# Altium project PiTopAIO.PrjPcb
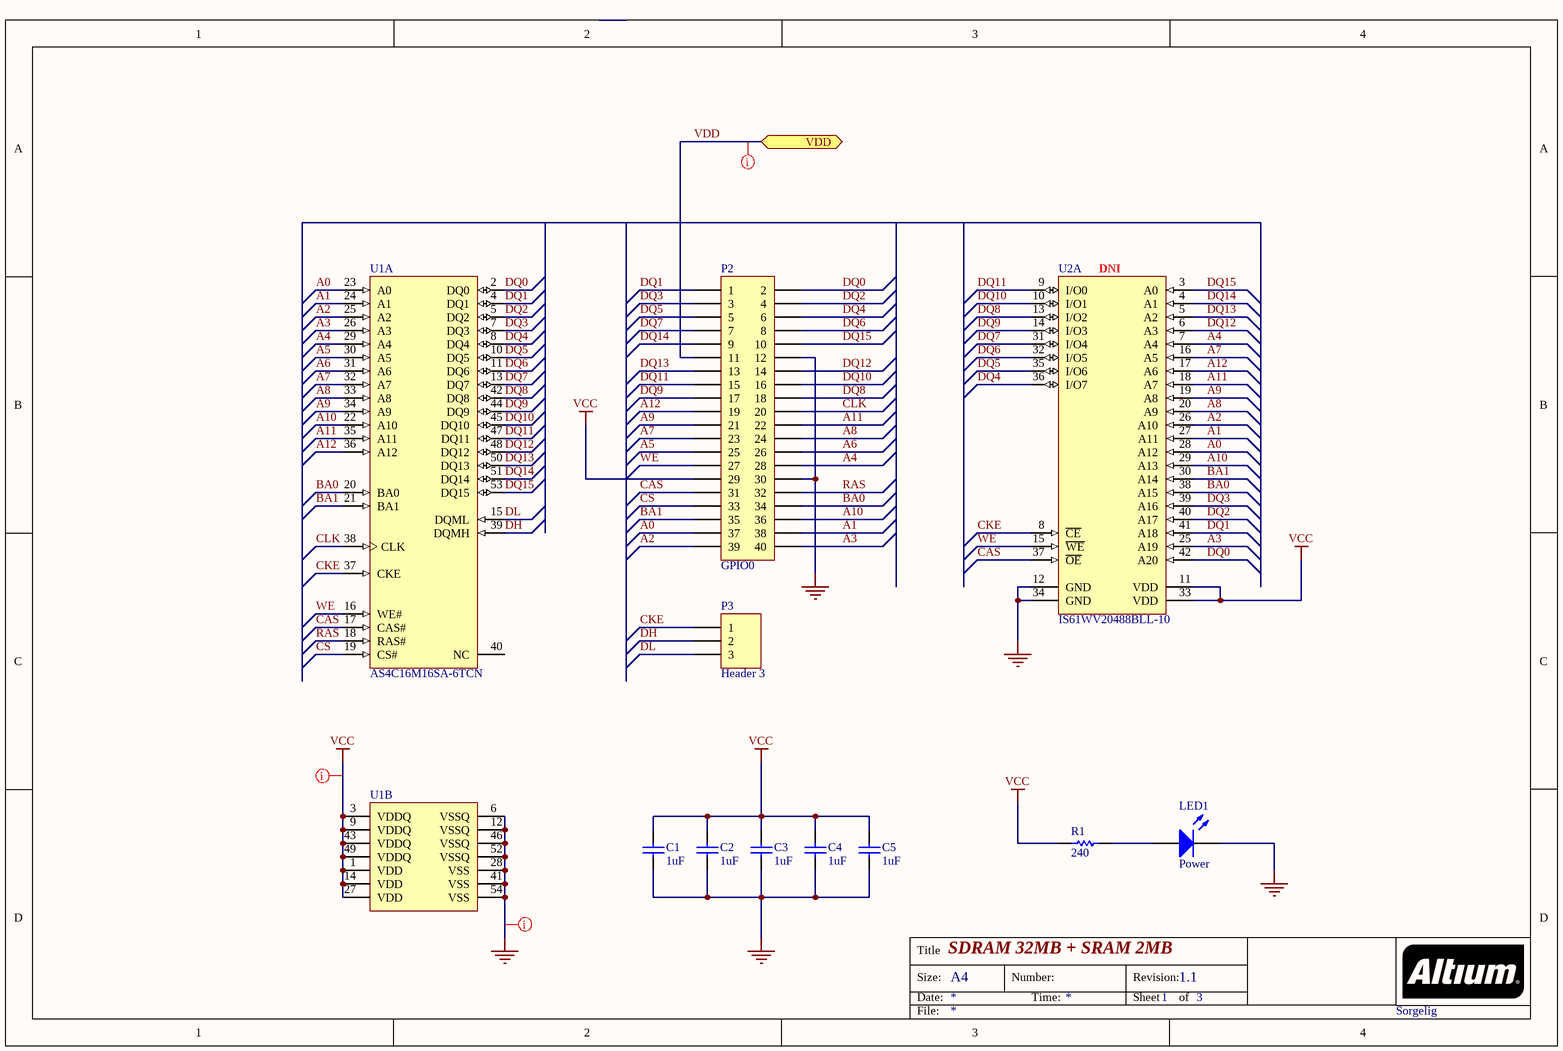
[diagram p0: ram.SchDoc]
3 sheets, 61 parts. Net scope: flat (ports and power ports of the same name join across sheets).
Board file: PiTopAIO.PcbDoc
Sheets:
  ram.SchDoc
  audio.SchDoc
  io.SchDoc

## Sheet ram.SchDoc: SDRAM 32MB + SRAM 2MB
size A4; Author: Sorgelig; Revision: 1.1; SheetNumber: 1; SheetTotal: 3

### Parts
C1  value 1uF  [C0805]  (hidden comment: C0805)
C2  value 1uF  [C0805]  (hidden comment: C0805)
C3  value 1uF  [C0805]  (hidden comment: +)
C4  value 1uF  [C0805]  (hidden comment: C0805)
C5  value 1uF  [C0805]  (hidden comment: +)
LED1  Power  [LEDB0805]
P2  GPIO0  [HDR20x2]
P3  Header 3  [HDR1X3]
R1  240  [R0805]
U1  AS4C16M16SA-6TCN  [TSOP54]  (parts A,B of 2)
U2  IS61WV20488BLL-10  [ISSI-TSOP-2-44_N]  (part A of 2)

### Ports
VDD

### Nets
GND: C1.1 C2.1 C3.1 C4.1 C5.1 LED1.2(K) P2.12 P2.30 U1.6(VSSQ) U1.12(VSSQ) U1.28(VSS) U1.41(VSS) U1.46(VSSQ) U1.52(VSSQ) U1.54(VSS) U2.12(GND) U2.34(GND)
VCC: C1.2 C2.2 C3.2 C4.2 C5.2 P2.29 R1.2 U1.1(VDD) U1.3(VDDQ) U1.9(VDDQ) U1.14(VDD) U1.27(VDD) U1.43(VDDQ) U1.49(VDDQ) U2.11(VDD) U2.33(VDD)
VDD: P2.11 ; port VDD
A0: P2.37 U1.23(A0) U2.28(A12)
A1: P2.38 U1.24(A1) U2.27(A11)
A2: P2.39 U1.25(A2) U2.26(A10)
A3: P2.40 U1.26(A3) U2.25(A19)
A4: P2.28 U1.29(A4) U2.7(A4)
A5: P2.25 U1.30(A5)
A6: P2.26 U1.31(A6)
A7: P2.23 U1.32(A7) U2.16(A5)
A8: P2.24 U1.33(A8) U2.20(A9)
A9: P2.21 U1.34(A9) U2.19(A8)
A10: P2.36 U1.22(A10) U2.29(A13)
A11: P2.22 U1.35(A11) U2.18(A7)
A12: P2.19 U1.36(A12) U2.17(A6)
BA0: P2.34 U1.20(BA0) U2.38(A15)
BA1: P2.35 U1.21(BA1) U2.30(A14)
CAS: P2.31 U1.17(CAS#) U2.37(~{OE})
CKE: P3.1 U1.37(CKE) U2.8(~{CE})
CLK: P2.20 U1.38(CLK)
CS: P2.33 U1.19(CS#)
DH: P3.2 U1.39(DQMH)
DL: P3.3 U1.15(DQML)
DQ0: P2.2 U1.2(DQ0) U2.42(A20)
DQ1: P2.1 U1.4(DQ1) U2.41(A18)
DQ2: P2.4 U1.5(DQ2) U2.40(A17)
DQ3: P2.3 U1.7(DQ3) U2.39(A16)
DQ4: P2.6 U1.8(DQ4) U2.36(I/O7)
DQ5: P2.5 U1.10(DQ5) U2.35(I/O6)
DQ6: P2.8 U1.11(DQ6) U2.32(I/O5)
DQ7: P2.7 U1.13(DQ7) U2.31(I/O4)
DQ8: P2.18 U1.42(DQ8) U2.13(I/O2)
DQ9: P2.17 U1.44(DQ9) U2.14(I/O3)
DQ10: P2.16 U1.45(DQ10) U2.10(I/O1)
DQ11: P2.15 U1.47(DQ11) U2.9(I/O0)
DQ12: P2.14 U1.48(DQ12) U2.6(A3)
DQ13: P2.13 U1.50(DQ13) U2.5(A2)
DQ14: P2.9 U1.51(DQ14) U2.4(A1)
DQ15: P2.10 U1.53(DQ15) U2.3(A0)
RAS: P2.32 U1.18(RAS#)
WE: P2.27 U1.16(WE#) U2.15(~{WE})
NetLED1_1: LED1.1(A) R1.1

Not connected (* = marked no-connect by the designer): U1 40(NC)

### Layout directives
net class power: GND, VCC, VDD

### Notes on the sheet
- (near U2) DNI
- Sorgelig
- Title
- Size:
- Date:
- A4
- Number:
- Time:
- Revision:
- Sheet
- of
- File:

### Library data of the parts
C1-C5 = C0805: Ceramic Chip Capacitor - Standard; Note: Footprint corresponds to dimensions for bulk cassette packaging. This case size has tightened tolerances.; Published: 17-Jul-2002; LatestRevisionDate: 19-Mar-2004; LatestRevisionNote: Silkscreen size reduced.; DatasheetDocument: Mar-2001; PackageDocument: Mar-2001; PackageReference: 0805; Publisher: Altium Limited; Code_JEITA: 0805; Code_IPC: 2012[0805]; ComponentLink1Description: Manufacturer Link; ComponentLink1URL: http://www.kemet.com/; ComponentLink2Description: Datasheet; ComponentLink2URL: http://www.kemet.com/kemet/web/homepage/kechome.nsf/vapubfilesname/F3102TA.pdf/$file/F3102TA.pdf
LED1 = LED2: Typical RED, GREEN, YELLOW, AMBER GaAs LED; Published: 8-Jun-2000; LatestRevisionDate: 17-Jul-2002; LatestRevisionNote: Re-released for DXP Platform.; PackageVersion: Feb-2002; PackageReference: 3.2X1.6X1.1; Publisher: Altium Limited; PackageDescription: SM LED; 2 Flat Leads
P2 = Header 20X2: Header, 20-Pin, Dual row; LatestRevisionDate: 17-Jul-2002; LatestRevisionNote: Re-released for DXP Platform.; Publisher: Altium Limited
P3 = Header 3: Header, 3-Pin; LatestRevisionDate: 17-Jul-2002; LatestRevisionNote: Re-released for DXP Platform.; Publisher: Altium Limited
R1 = ERJ6RS: Low Ohmic Value Thick Film Chip Resistor, 0.1 Ohm to 0.2 Ohm Range, 1%, 2% and 5% Tolerance, 0805 Size, 0.125 W; Published: 17-Dec-2003; LatestRevisionDate: 19-Mar-2004; LatestRevisionNote: Silkscreen size reduced.; PackageDocument: Mar-2003; PackageReference: 6-0805; Publisher: Altium Limited; Code_IPC: 2012 [0805]; ComponentLink1Description: Manufacturer Link; ComponentLink1URL: http://www.panasonic.com/industrial/components/resistive_products.htm; ComponentLink2Description: Datasheet; ComponentLink2URL: http://www.panasonic.com/industrial/components/pdf/AOA0000CE3.pdf
U1 = AS4C16M16SA-6TCN: 256Mb SDR SDRAM, 16Mb x 16, 6ns, 3.3V, 54-Pin TSOP; Manufacturer: Micron; PartNumber: MT48LC16M16A2P-6A; CL: CL = 3; Clock Rate: 167 MHz; Data Rate: PC133; Op. Temp.: 0C to +70C; DatasheetVersion: Rev.Q; PackageVersion: Rev.Q; PackageReference: MICT-P-54; PackageDescription: 54-Pin Thin Small Outline Package, 10.16 x 22.22 mm, Pitch 0.8 mm; Cycle Time: 6ns; Density: 256Mb; Depth: 16Mb; RoHS: Yes; Voltage: 3.3V; Width: x16; Mounting Technology: Surface Mount; ComponentLink1Description: Manufacturer URL; ComponentLink1URL: http://www.micron.com/; ComponentLink2Description: Datasheet; ComponentLink2URL: http://www.micron.com/~/media/Documents/Products/Data%20Sheet/DRAM/256Mb_sdr.pdf; ComponentLink3Description: Package Specification; ComponentLink3URL: http://www.micron.com/~/media/Documents/Products/Data%20Sheet/DRAM/128mb_x4x8x16_sdram.pdf
U2 = IS61WV20488BLL-10TI: 16 M High Speed CMOS SRAM, 2 M x 8, -40 to 85 degC, 44-Pin SOP (TSOP-2-44); Manufacturer: Integrated Silicon Solution Inc (ISSI); Organization: 2M x 8; Packing: Tray / Tube; Speed (ns): 10; DatasheetVersion: Rev. B; PackageVersion: Rev. F, 06/2008; PackageReference: TSOP-2-44; PackageDescription: 44-Pin 400 mil TSOP-2, Body 18.41 x 10.16 mm, Pitch 0.8 mm; Mounting Technology: Surface Mount; PartNumber: IS61WV20488BLL-10TI; ComponentLink1Description: Manufacturer URL; ComponentLink1URL: http://www.issi.com/US/index.shtml; ComponentLink2Description: Datasheet; ComponentLink2URL: http://www.issi.com/WW/pdf/61-64WV20488.pdf; ComponentLink3Description: Package Specification; ComponentLink3URL: http://www.issi.com/WW/pdf/61-64WV6416EEBLL.pdf

## Sheet audio.SchDoc: Audio
size A4; Author: Sorgelig; Revision: 1.1; SheetNumber: 2; SheetTotal: 3
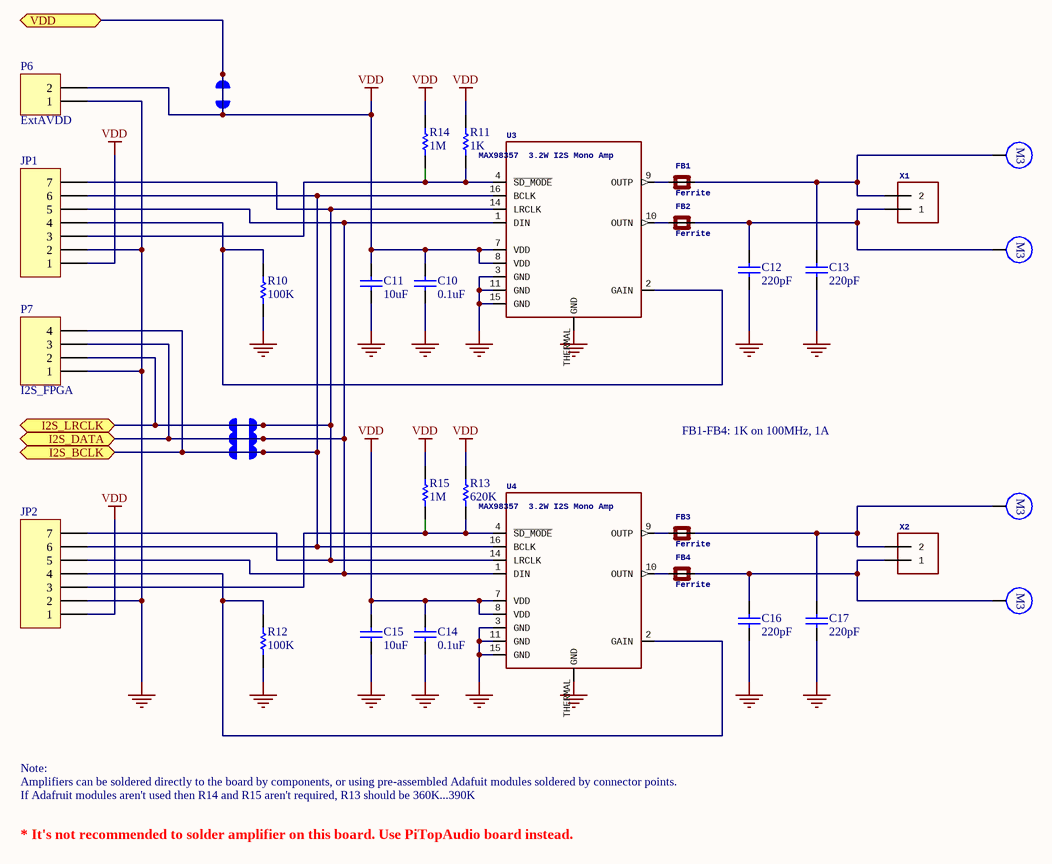
[diagram p1: audio.SchDoc]

### Parts
C10  value 0.1uF  [C0805]  (hidden comment: C0805)
C11  value 10uF  [C0805]  (hidden comment: C0805)
C12  value 220pF  [C0805]  (hidden comment: C0805)
C13  value 220pF  [C0805]  (hidden comment: C0805)
C14  value 0.1uF  [C0805]  (hidden comment: C0805)
C15  value 10uF  [C0805]  (hidden comment: C0805)
C16  value 220pF  [C0805]  (hidden comment: C0805)
C17  value 220pF  [C0805]  (hidden comment: C0805)
CUT1  CUT  [CUT]  (value not drawn)
CUT2  CUT  [CUT]  (value not drawn)
CUT3  CUT  [CUT]  (value not drawn)
CUT4  CUT  [CUT]  (value not drawn)
FB1  Ferrite  [FB0805]
FB2  Ferrite  [FB0805]
FB3  Ferrite  [FB0805]
FB4  Ferrite  [FB0805]
H11  M3  [M3]  (value not drawn)
H12  M3  [M3]  (value not drawn)
H13  M3  [M3]  (value not drawn)
H14  M3  [M3]  (value not drawn)
JP1  Header 7  [HDR1X7]  (value not drawn)
JP2  Header 7  [HDR1X7]  (value not drawn)
P6  ExtAVDD  [HDR1X2]
P7  I2S_FPGA  [HDR1X4]
R10  100K  [R0805]
R11  1K  [R0805]
R12  100K  [R0805]
R13  620K  [R0805]
R14  1M  [R0805]
R15  1M  [R0805]
U3  MAX98357
3.2WI2SMonoAmp: MAX98357 / 3.2W I2S Mono Amp  [QFN16_3MM]  (hidden comment: MAX98357A)
U4  MAX98357
3.2WI2SMonoAmp: MAX98357 / 3.2W I2S Mono Amp  [QFN16_3MM]  (hidden comment: MAX98357A)
X1  TERMBLOCK_1X2  [TERMBLOCK_1X2-3.5MM]  (value not drawn)
X2  TERMBLOCK_1X2  [TERMBLOCK_1X2-3.5MM]  (value not drawn)

### Ports
I2S_BCLK, I2S_DATA, I2S_LRCLK, VDD

### Nets
GND: C10.1 C11.1 C12.1 C13.1 C14.1 C15.1 C16.1 C17.1 JP1.2 JP2.2 P6.1 P7.1 R10.2 R12.2 U3.3(GND) U3.11(GND) U3.15(GND) U3.THERMAL(GND) U4.3(GND) U4.11(GND) U4.15(GND) U4.THERMAL(GND)
VDD: C10.2 C11.2 C14.2 C15.2 CUT4.1 JP1.1 JP2.1 P6.2 R11.1 R13.1 R14.1 R15.1 U3.7(VDD) U3.8(VDD) U4.7(VDD) U4.8(VDD) ; port VDD
I2S_BCLK: CUT1.1 JP1.6 JP2.6 P7.4 U3.16(BCLK) U4.16(BCLK) ; port I2S_BCLK
I2S_DATA: CUT3.1 JP1.5 JP2.5 P7.3 U3.1(DIN) U4.1(DIN) ; port I2S_DATA
I2S_LRCLK: CUT2.1 JP1.7 JP2.7 P7.2 U3.14(LRCLK) U4.14(LRCLK) ; port I2S_LRCLK
NetC12_2: C12.2 FB2.2(P$2) H12.1 X1.1
NetC13_2: C13.2 FB1.2(P$2) H11.1 X1.2
NetC16_2: C16.2 FB4.2(P$2) H14.1 X2.1
NetC17_2: C17.2 FB3.2(P$2) H13.1 X2.2
NetFB1_1: FB1.1(P$1) U3.9(OUTP)
NetFB2_1: FB2.1(P$1) U3.10(OUTN)
NetFB3_1: FB3.1(P$1) U4.9(OUTP)
NetFB4_1: FB4.1(P$1) U4.10(OUTN)
NetJP1_3: JP1.3 R11.2 R14.2 U3.4(~{SD_MODE})
NetJP1_4: JP1.4 R10.1 U3.2(GAIN)
NetJP2_3: JP2.3 R13.2 R15.2 U4.4(~{SD_MODE})
NetJP2_4: JP2.4 R12.1 U4.2(GAIN)

### Notes on the sheet
- FB1-FB4: 1K on 100MHz, 1A
- Note:
- Amplifiers can be soldered directly to the board by components, or using pre-assembled Adafuit modules soldered by connector points.
- If Adafruit modules aren't used then R14 and R15 aren't required, R13 should be 360K...390K
- * It's not recommended to solder amplifier on this board. Use PiTopAudio board instead.
- Title
- Size:
- Date:
- A4
- Number:
- Time:
- Revision:
- Sheet
- of
- File:

### Library data of the parts
C10-C17 = C0805: as C1 on sheet ram; Published: 17-Jul-2002; LatestRevisionDate: 19-Mar-2004; LatestRevisionNote: Silkscreen size reduced.; DatasheetDocument: Mar-2001; PackageDocument: Mar-2001; PackageReference: 0805; Publisher: Altium Limited; Code_JEITA: 0805; Code_IPC: 2012[0805]; ComponentLink1Description: Manufacturer Link; ComponentLink1URL: http://www.kemet.com/; ComponentLink2Description: Datasheet; ComponentLink2URL: http://www.kemet.com/kemet/web/homepage/kechome.nsf/vapubfilesname/F3102TA.pdf/$file/F3102TA.pdf
FB1-FB4 = FERRITE-0805NO: Ferrite Bead   0603 MMZ1608B121C - 120 Ohm @ 100MHz, 600mA, 0.15 Ohm DC Resistance - Digikey: 445-2164-1-ND  BK1608HW121-T - 120 Ohm, 600mA Ferrite Chip - Digikey: 587-1876-2-ND       0805 HZ0805B272R-10 - 2.7K Ohm @ 100MHz, 200mA, 0.8 Ohm DC Resistance - Digikey: 240-2504-1-ND (see also Murata BLM21BD272SN1L)  MMZ2012Y152B - 1.5K Ohm @ 100MHz, 500mA, 0.4 Ohm DC Resistance - Digikey: 445-1560-1-ND - Mainly for high frequency (80-400MHz)  MMZ2012R102A - 1K Ohm @ 100MHz, 500mA, 0.3 Ohm DC Resistance - Digikey: 445-1555-2-ND - More general purpose (10-200MHz)
JP1 JP2 = Header 7: Header, 7-Pin; LatestRevisionDate: 17-Jul-2002; LatestRevisionNote: Re-released for DXP Platform.; Publisher: Altium Limited
P6 = Header 2: Header, 2-Pin; LatestRevisionDate: 17-Jul-2002; LatestRevisionNote: Re-released for DXP Platform.; Publisher: Altium Limited
P7 = Header 4: Header, 4-Pin; LatestRevisionDate: 17-Jul-2002; LatestRevisionNote: Re-released for DXP Platform.; Publisher: Altium Limited
R10-R15 = ERJ6RS: as R1 on sheet ram; Published: 17-Dec-2003; LatestRevisionDate: 19-Mar-2004; LatestRevisionNote: Silkscreen size reduced.; PackageDocument: Mar-2003; PackageReference: 6-0805; Publisher: Altium Limited; Code_IPC: 2012 [0805]; ComponentLink1Description: Manufacturer Link; ComponentLink1URL: http://www.panasonic.com/industrial/components/resistive_products.htm; ComponentLink2Description: Datasheet; ComponentLink2URL: http://www.panasonic.com/industrial/components/pdf/AOA0000CE3.pdf
U3 U4 = MAX98357: MAX98357 - 3.2W I2S Mono Audio Amp; VDD:
Op.Temp: VDD: / Op. Temp:; 2.5-5.5V
-40~85В°C: 2.5-5.5V / -40~85В°C
X1 X2 = TERMBLOCK_1X2: 3.5mm Terminal block    http://www.ladyada.net/library/pcb/eaglelibrary.html

## Sheet io.SchDoc: SD Cards
size A4; Author: Sorgelig; Revision: 1.1; SheetNumber: 3; SheetTotal: 3
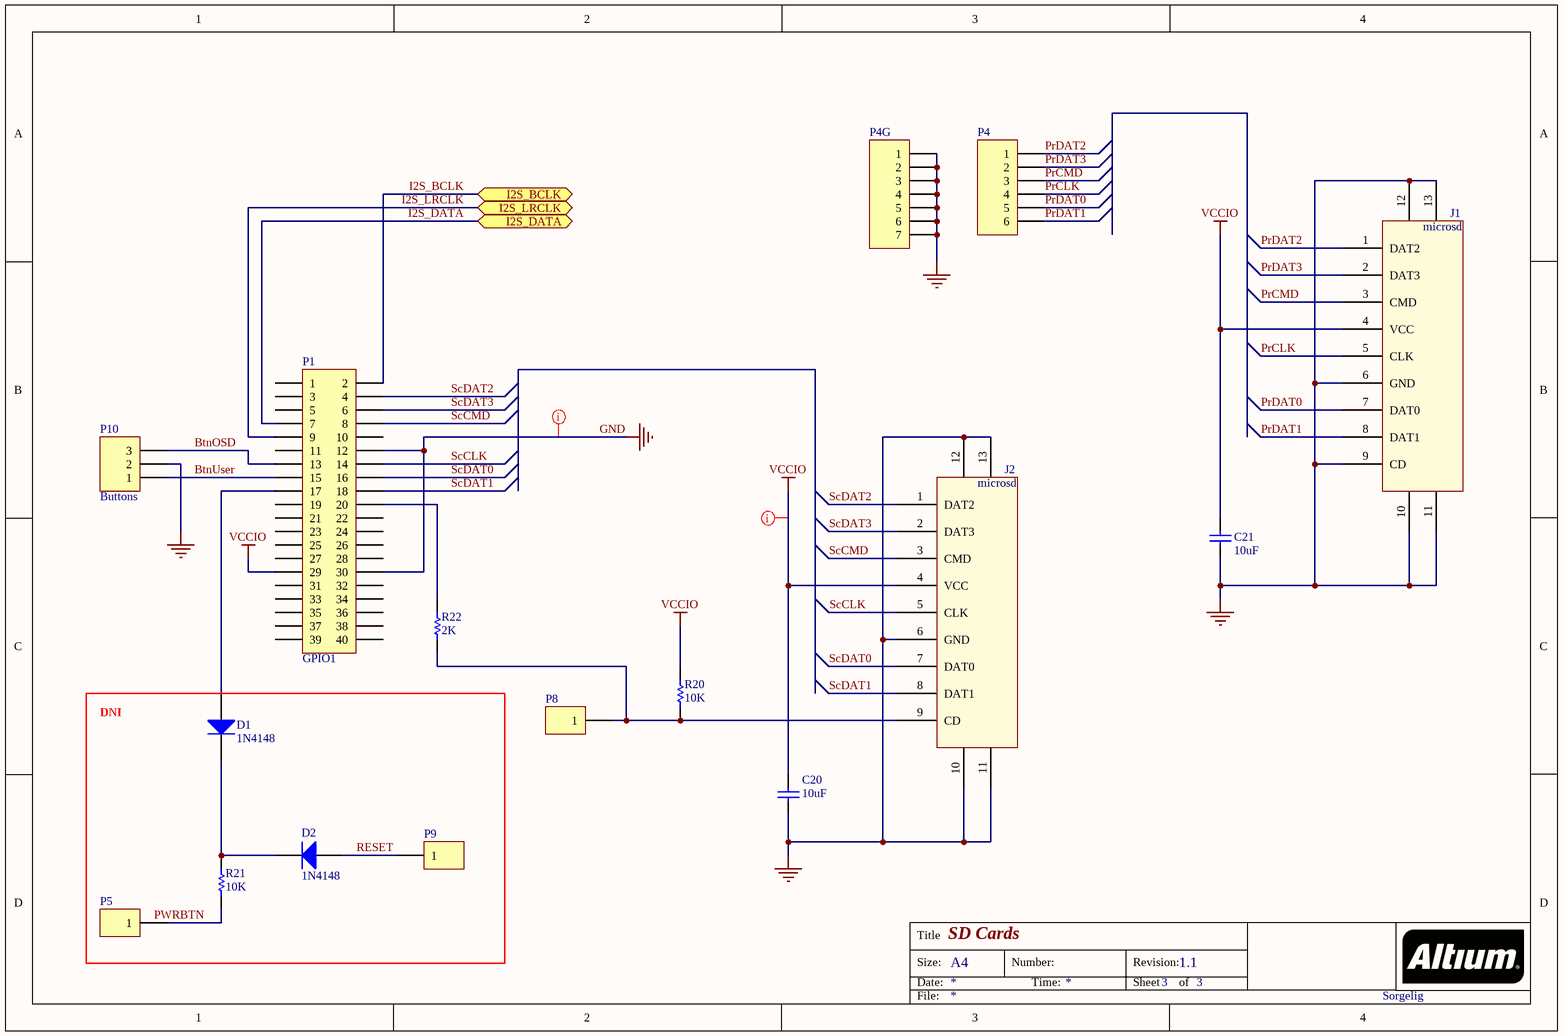
[diagram p2: io.SchDoc]

### Parts
C20  value 10uF  [C0805]  (hidden comment: C0805)
C21  value 10uF  [C0805]  (hidden comment: C0805)
D1  1N4148  [DIODE]
D2  1N4148  [DIODE]
J1  microsd  [microsd]
J2  microsd  [microsd]
P1  GPIO1  [HDR20x2]
P4  Header 6  [HDR1X6]  (value not drawn)
P4G  Header 7  [HDR1X7]  (value not drawn)
P5  Header 1  [Header 1]  (value not drawn)
P8  Header 1  [Header 1]  (value not drawn)
P9  Header 1  [Header 1]  (value not drawn)
P10  Buttons  [HDR1X3]
R20  10K  [R0805]
R21  10K  [R0805]
R22  2K  [R0805]

### Blocks framed on the sheet
DNI: D1 D2 P5 P9 R21

### Ports
I2S_BCLK, I2S_DATA, I2S_LRCLK

### Nets
GND: C20.1 C21.1 J1.6(GND) J1.9(CD) J1.10(GND) J1.11(GND) J1.12(GND) J1.13(GND) J2.6(GND) J2.10(GND) J2.11(GND) J2.12(GND) J2.13(GND) P1.12 P1.30 P4G.1 P4G.2 P4G.3 P4G.4 P4G.5 P4G.6 P4G.7 P10.2
VCCIO: C20.2 C21.2 J1.4(VCC) J2.4(VCC) P1.29 R20.2
BtnOSD: P1.13 P10.3
BtnUser: P1.15 P10.1
I2S_BCLK: P1.2 ; port I2S_BCLK
I2S_DATA: P1.7 ; port I2S_DATA
I2S_LRCLK: P1.9 ; port I2S_LRCLK
PrCLK: J1.5(CLK) P4.4
PrCMD: J1.3(CMD) P4.3
PrDAT0: J1.7(DAT0) P4.5
PrDAT1: J1.8(DAT1) P4.6
PrDAT2: J1.1(DAT2) P4.1
PrDAT3: J1.2(DAT3) P4.2
RESET: D2.1(A) P9.1
ScCLK: J2.5(CLK) P1.14
ScCMD: J2.3(CMD) P1.8
ScDAT0: J2.7(DAT0) P1.16
ScDAT1: J2.8(DAT1) P1.18
ScDAT2: J2.1(DAT2) P1.4
ScDAT3: J2.2(DAT3) P1.6
NetD1_1: D1.1(A) P1.17
NetD1_2: D1.2(K) D2.2(K) R21.1
NetJ2_9: J2.9(CD) P8.1 R20.1 R22.1
NetP1_20: P1.20 R22.2
NetP5_1: P5.1 R21.2

Not connected (* = marked no-connect by the designer): P1 1 3 5 10 11 19 21 22 23 24 25 26 27 28 31 32 33 34 35 36 37 38 39 40

### Layout directives
net class power: GND, VCCIO

### Notes on the sheet
- Sorgelig
- Labels drawn without touching a wire or pin: PWRBTN
- Title
- Size:
- Date:
- A4
- Number:
- Time:
- Revision:
- Sheet
- of
- File:

### Library data of the parts
C20 C21 = C0805: as C1 on sheet ram; Published: 17-Jul-2002; LatestRevisionDate: 19-Mar-2004; LatestRevisionNote: Silkscreen size reduced.; DatasheetDocument: Mar-2001; PackageDocument: Mar-2001; PackageReference: 0805; Publisher: Altium Limited; Code_JEITA: 0805; Code_IPC: 2012[0805]; ComponentLink1Description: Manufacturer Link; ComponentLink1URL: http://www.kemet.com/; ComponentLink2Description: Datasheet; ComponentLink2URL: http://www.kemet.com/kemet/web/homepage/kechome.nsf/vapubfilesname/F3102TA.pdf/$file/F3102TA.pdf
D1 D2 = Diode: Default Diode; Published: 8-Jun-2000; LatestRevisionDate: 17-Jul-2002; LatestRevisionNote: Re-released for DXP Platform.; PackageVersion: Sep-1996; PackageReference: SMC; Publisher: Altium Limited; PackageDescription: DO-214-AB/SMC; 2 C-Bend Leads; Body 7.9 x 5.9 mm, inc. leads (LxW); Code_JEDEC: DO-214-AB
P1 = Header 20X2: Header, 20-Pin, Dual row; LatestRevisionDate: 17-Jul-2002; LatestRevisionNote: Re-released for DXP Platform.; Publisher: Altium Limited
P4 = Header 6: Header, 6-Pin; LatestRevisionDate: 17-Jul-2002; LatestRevisionNote: Re-released for DXP Platform.; Publisher: Altium Limited
P4G = Header 7: Header, 7-Pin; LatestRevisionDate: 17-Jul-2002; LatestRevisionNote: Re-released for DXP Platform.; Publisher: Altium Limited
P10 = Header 3: Header, 3-Pin; LatestRevisionDate: 17-Jul-2002; LatestRevisionNote: Re-released for DXP Platform.; Publisher: Altium Limited
R20-R22 = ERJ6RS: as R1 on sheet ram; Published: 17-Dec-2003; LatestRevisionDate: 19-Mar-2004; LatestRevisionNote: Silkscreen size reduced.; PackageDocument: Mar-2003; PackageReference: 6-0805; Publisher: Altium Limited; Code_IPC: 2012 [0805]; ComponentLink1Description: Manufacturer Link; ComponentLink1URL: http://www.panasonic.com/industrial/components/resistive_products.htm; ComponentLink2Description: Datasheet; ComponentLink2URL: http://www.panasonic.com/industrial/components/pdf/AOA0000CE3.pdf

## Nets that join several sheets
GND: ram (17 pins), audio (22 pins), io (23 pins)
VDD: ram (P2.11), audio (16 pins)
I2S_BCLK: audio (6 pins), io (P1.2)
I2S_DATA: audio (6 pins), io (P1.7)
I2S_LRCLK: audio (6 pins), io (P1.9)